# EAGLE design emonDCmini v0.8 (EAGLE 9.4.2)
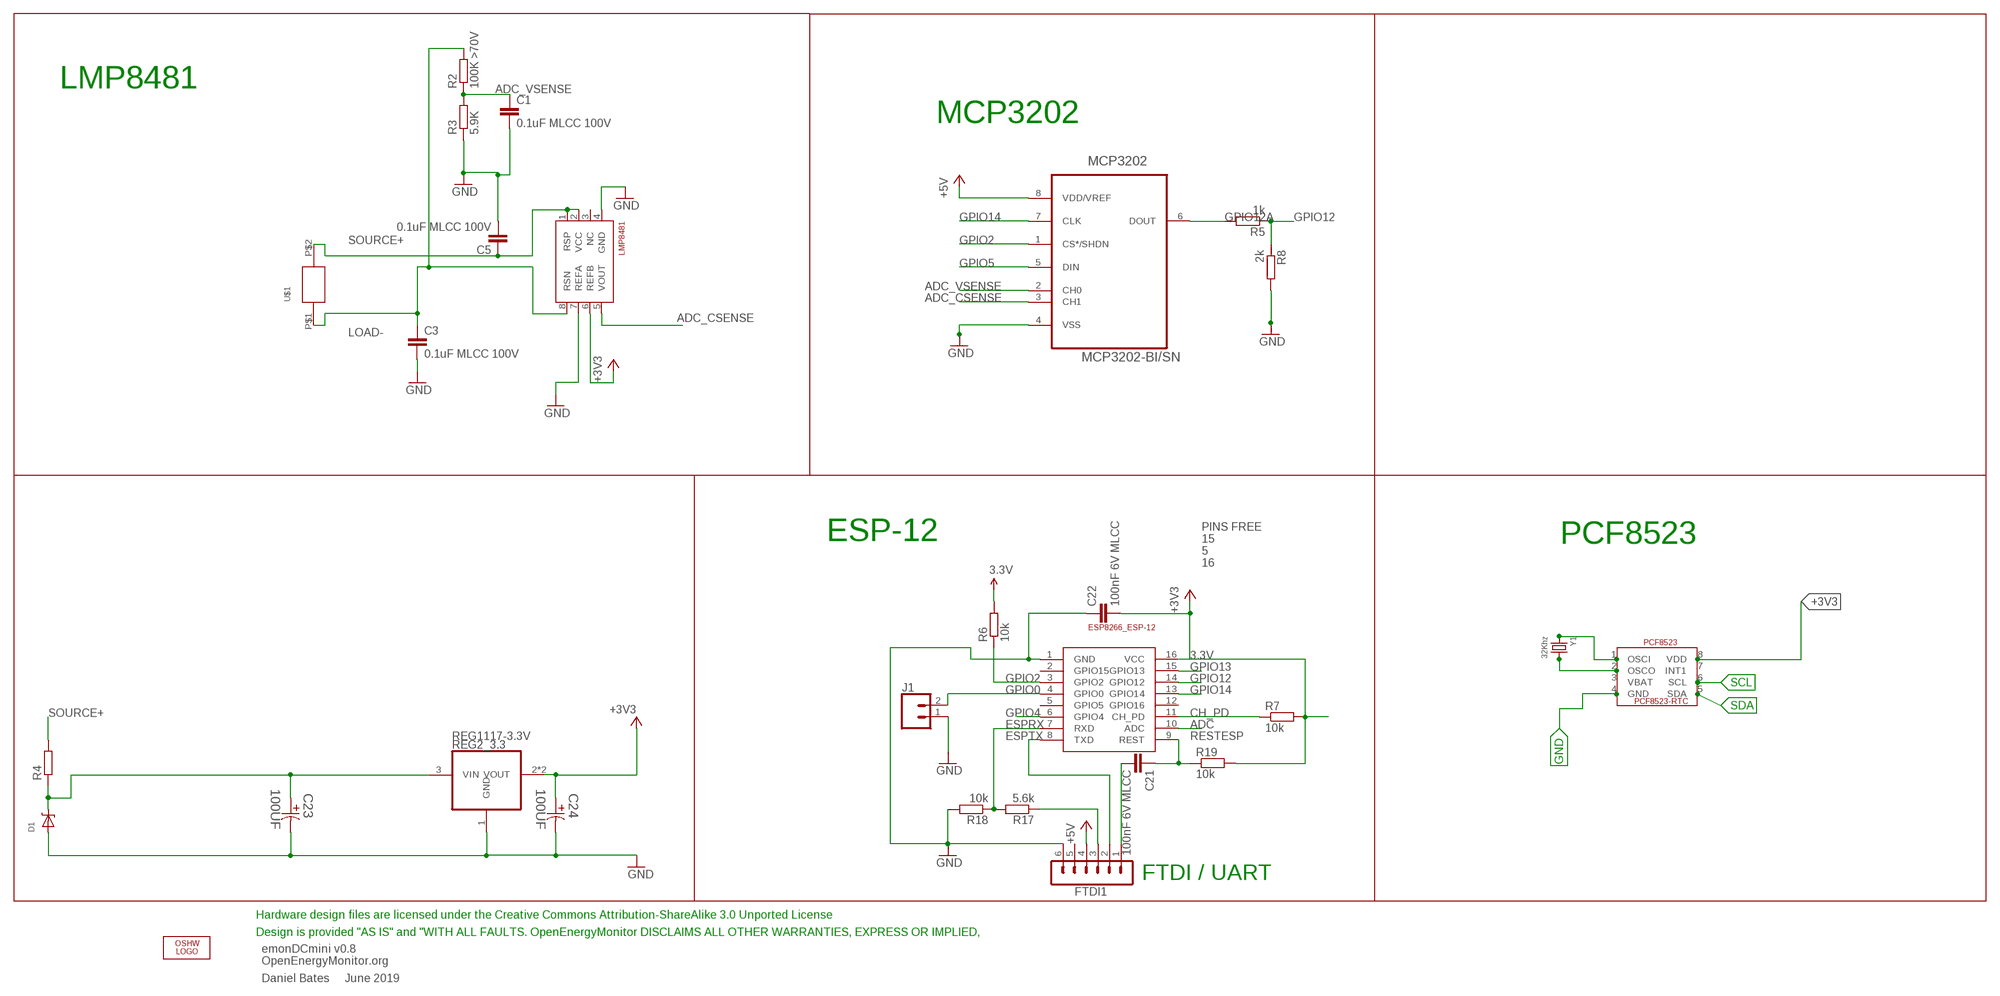
[diagram p0: schematic, sheet 1]

## Parts
C1  0.1uF MLCC 100V  C-EUC0805  [C0805]
C3  0.1uF MLCC 100V  C-EUC0805  [C0805]
C5  0.1uF MLCC 100V  C-EUC0805  [C0805]
C21  100nF 6V MLCC  C-EUC0805  [C0805]
C22  100nF 6V MLCC  C-EUC0805  [C0805]
C23  100UF  EEE-0JA101WAR-CASE-C  [CAPAE530X610N]
C24  100UF  EEE-0JA101WAR-CASE-C  [CAPAE530X610N]
D1  DIODE-ZENER  [SMADIODE]
ESP-12  ESP8266_ESP-12  [ESP8266-ESP12]
FTDI1  FTDI-ESP  MA06-1  [MA06-1]
J1  CONN_02  [1X02]
LMP8481  LMP8481-H  LMP8481LMP8481-H  [S-PDSO-G08]
LOGO1  OSHW_LOGO_6MILX0200-NT  [OSHW_6X200_NOTEXT]
MCP3202  MCP3202-BI/SN  [SOIC127P600X175-8N]
PCF8523  PCF8523_RTC  [SOIC_8]
R2  100K >70V  R-EU_R0603  [R0603]
R3  5.9K  R-EU_R0603  [R0603]
R4  R-EU_R2512  [R2512]
R5  1k  R-EU_R0603  [R0603]
R6  10k  R-EU_R0603  [R0603]
R7  10k  R-EU_R0603  [R0603]
R8  2k  R-EU_R0603  [R0603]
R17  5.6k  R-EU_R0603  [R0603]
R18  10k  R-EU_R0603  [R0603]
R19  10k  R-EU_R0603  [R0603]
REG2_3.3  REG1117-3.3V  REG1117  [SOT223]
U$1  EBW_SERIES_10.5MM  [EBW_SERIES_10.5MM]
Y1  32Khz  CRYSTAL8X3.8SMT  [CRYSTAL_8X3.8]

## Nets
3.3V: C22.2 ESP-12.16(VCC) LMP8481.6(REFB) R6.2 R7.2 R19.2 ; supply symbol labelled +3V3
6.5V [thin_power]: C23.1 D1.C R4.1 REG2_3.3.3(VIN)
+3V3 [thin_power]: C24.1 PCF8523.8(VDD) REG2_3.3.2(VOUT) REG2_3.3.4(VOUT)
+5V: FTDI1.4 MCP3202.8(VDD/VREF)
ADC: ESP-12.10(ADC)
ADC_CSENSE: LMP8481.5(VOUT) MCP3202.3(CH1)
ADC_VSENSE: C1.1 MCP3202.2(CH0) R2.1 R3.2
CH_PD: ESP-12.11(CH_PD) R7.1
ESPRX: ESP-12.7(RXD) R17.2 R18.1
ESPTX: ESP-12.8(TXD) FTDI1.2
GND [thin_power]: C1.2 C3.2 C5.2 C22.1 C23.2 C24.2 D1.A ESP-12.1(GND) FTDI1.6 J1.1 LMP8481.4(GND) LMP8481.7(REFA) MCP3202.4(VSS) PCF8523.4(GND) R3.1 R8.2 R18.2 REG2_3.3.1(GND)
GPIO0: ESP-12.4(GPIO0) J1.2
GPIO2: ESP-12.3(GPIO2) MCP3202.1(CS*/SHDN) R6.1
GPIO4: ESP-12.6(GPIO4)
GPIO5: MCP3202.5(DIN)
GPIO12: ESP-12.14(GPIO12) R5.1 R8.1
GPIO12A: MCP3202.6(DOUT) R5.2
GPIO13: ESP-12.15(GPIO13)
GPIO14: ESP-12.13(GPIO14) MCP3202.7(CLK)
LOAD- [power]: C3.1 LMP8481.8(RSN) R2.2 U$1.P$1
N$36: FTDI1.3 R17.1
N$44: PCF8523.2(OSCO) Y1.P$4
N$45: PCF8523.1(OSCI) Y1.P$1
RESTESP: C21.1 ESP-12.9(REST) R19.1
RST: C21.2 FTDI1.1
SCL: PCF8523.6(SCL)
SDA: PCF8523.5(SDA)
SOURCE+ [power]: C5.1 LMP8481.1(RSP) LMP8481.2(VCC) R4.2 U$1.P$2
Unconnected: ESP-12.2(GPIO15) ESP-12.5(GPIO5) ESP-12.12(GPIO16) FTDI1.5 LMP8481.3(NC) PCF8523.3(VBAT) PCF8523.7(INT1)

## Notes on the sheet
- LMP8481
- MCP3202
- ESP-12 | PCF8523
- PINS FREE
  15
  5
  16
- FTDI / UART
- Hardware design files are licensed under the Creative Commons Attribution-ShareAlike 3.0 Unported License
- Design is provided "AS IS" and "WITH ALL FAULTS. OpenEnergyMonitor DISCLAIMS ALL OTHER WARRANTIES, EXPRESS OR IMPLIED,
- emonDCmini v0.8
  OpenEnergyMonitor.org
- Daniel Bates     June 2019

## Library data of the parts
C1 C3 C5 C21 C22 = rcl:C-EU: CAPACITOR, European symbol; SPICEPREFIX: C
C23 C24 = Panasonic-EEE0_EEE1_EEE2_EEEFC:EEE-: Aluminum Electrolytic Capacitors,Surface Mount Type; MPN: EEE-0JA101WAR; OC_FARNELL: 2284723; OC_NEWARK: 53W3731; PACKAGE: CASE-C; SUPPLIER: PANASONIC; TOLERANCE: 20%; VOLTAGERATING: 6.3V
D1 = microbuilder:DIODE-ZENER: Zener Diode SMA: 30V 1W Zener Diode, 1.2Vf - Digikey: SMAZ30-FDICT-ND
ESP-12 = ESP8266-ESP12:ESP8266_ESP-12
FTDI1 = JeeLabs:MA06-1: PIN HEADER
J1 = SparkFun-Connectors:CONN_02: Multi connection point. Often used as Generic Header-pin footprint for 0.1 inch spaced/style header connections On any of the 0.1 inch spaced packages, you can populate with these: Break Away Headers - Straight <https://www.sparkfun.com/products/116> (PRT-00116) Break Away Male Headers - Right Angle <https://www.sparkfun.com/products/553> (PRT-00553) Female Headers <https://www.sparkfun.com/products/115> (PRT-00115) Break Away Headers - Machine Pin <https://www.sparkfun.com/products/117> (PRT-00117) Break Away Female Headers - Swiss Machine Pin <https://www.sparkfun.com/products/743> (PRT-00743) For SCREWTERMINALS and SPRING TERMINALS visit here: Screw Terimnals on SparkFun.com <https://www.sparkfun.com/search/results?term=Screw+Terminals> (5mm/3.5mm/2.54mm spacing) This device is also useful as a general connection point to wire up your design to another part of your project. Our various solder wires solder well into these plated through hole pads. Hook-Up Wire - Assortment (Stranded, 22 AWG) <https://www.sparkfun.com/products/11375> (PRT-11375) Hook-Up Wire - Assortment (Solid Core, 22 AWG) <https://www.sparkfun.com/products/11367> (PRT-11367) View the entire wire category on our website here <https://www.sparkfun.com/categories/141> Special notes: Molex polarized connector foot print use with: PRT-08233 with associated crimp pins and housings. 2.54_SCREWTERM for use with PRT-10571. 3.5mm Screw Terminal footprints for PRT-08084 5mm Screw Terminal footprints for use with PRT-08432
LMP8481 = lmp8481b:LMP8481: LMP8481MM-H/NOPB 100V/V
LOGO1 = ohw-logo:OSHW_LOGO_6MIL; OC_FARNELL: unknown
MCP3202 = Microchip-MCP3202-BI_SN:MCP3202-BI/SN: IC ADC 12BIT 2.7V 2CH SPI,SOIC-8; MPN: MCP3202-BI/SN; OC_FARNELL: 1196803; OC_NEWARK: 96K3721; PACKAGE: SOIC-8; SUPPLIER: Microchip
PCF8523 = emonDC parts:PCF8523_RTC: PCF8523-RTC SOIC-8
R2 = rcl:R-EU_: RESISTOR, European symbol; MPN: MCWR06X1003FTL
R3 = rcl:R-EU_: RESISTOR, European symbol; MPN: MCWR06X5901FTL
R4 = rcl:R-EU_: RESISTOR, European symbol; SPICEPREFIX: R
R5-R8 R17-R19 = rcl:R-EU_: RESISTOR, European symbol
REG2_3.3 = burr-brown-db:REG1117: 800mA and 1A Low Dropout (LDO) Positive Regulator 1.8V, 2.5V, 2.85V, 3.3V, 5V, and Adj; MF: TEXAS INSTRUMENTS; MPN: REG1117-3.3; OC_FARNELL: 1097566; OC_NEWARK: 14P6981
U$1 = EBW series SHUNT:EBW_SERIES_10.5MM
Y1 = microbuilder:CRYSTAL: Crystals HC49UP - Surface Mount Crystal 4.0MHz 18pF +/-30ppm Surface Mount Crystal [Digikey: 535-9857-1-ND] 12.0 MHz Surface Mount Crystal [Digikey: 535-9869-6-ND] 25.0 MHz Surface Mount Crystal [Digikey: 535-9078-1-ND] 2.5 x 2.0mm - MEMs SMT Crystal 16.0 MHz 10pF 20ppm 2.5 x 2.0mm Crystal [Digikey -40-85°C: 535-10923-1-ND] 3.2 x 2.5mm - MEMs SMT Crystal 12.0 MHz 8pF 15ppm 3.2 x 2.5mm Crystal [Digikey: -10-70°C: 644-1047-1-ND -40-125°C: 644-1128-1-ND] 16.0 MHz 8pF 15ppm 3.2 x 2.5mm Crystal [Digikey: -10-70°C: 644-1049-1-ND -40-125°C: 644-1129-2-ND] 16.0 MHz 10pF 10ppm 3.2 x 2.5mm Crystal [Digikey: 644-1100-1-ND] 27.12 MHz 18pF 30ppm 3.2 x 2.5mm Crystal [Digikey: 887-1424-1-ND] 27.12MHz 10pF 10ppm 3.2 x 2.5mm Crystal [Digikey: 887-1329-1-ND] 4.9 x 1.8mm - MEMs SMT Crystal 32.768 KHz 12.5pF 20ppm 4.9 x 1.8mm Crystal [Digikey: SE2415CT-ND] 8.0 x 3.8mm - Surface Mount Crystal 32.768kHz 12.5pF 20ppm -40°C-85°C [Digikey: 535-9166-2-ND] Cylinder 32.768KHz Cylinder Crystal (2x6mm body) [Ex. Digikey: 300-8341-2-ND]

## Net classes
0 default: clearance 0.254 mm
1 power: width 1.016 mm
2 thin_power: width 0.254 mm, clearance 0.254 mm
3 thin_power2: width 0.254 mm, clearance 0.254 mm

## Board
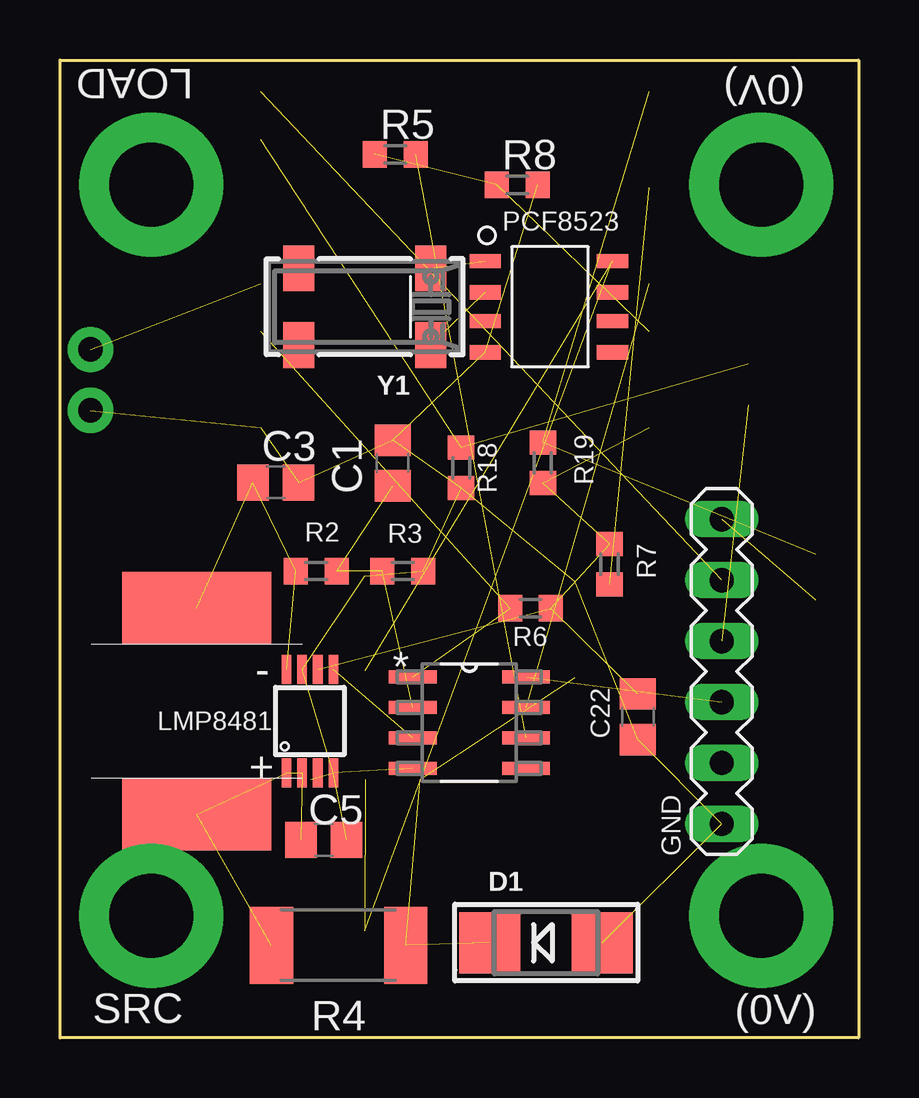
[diagram p1: board, top side]
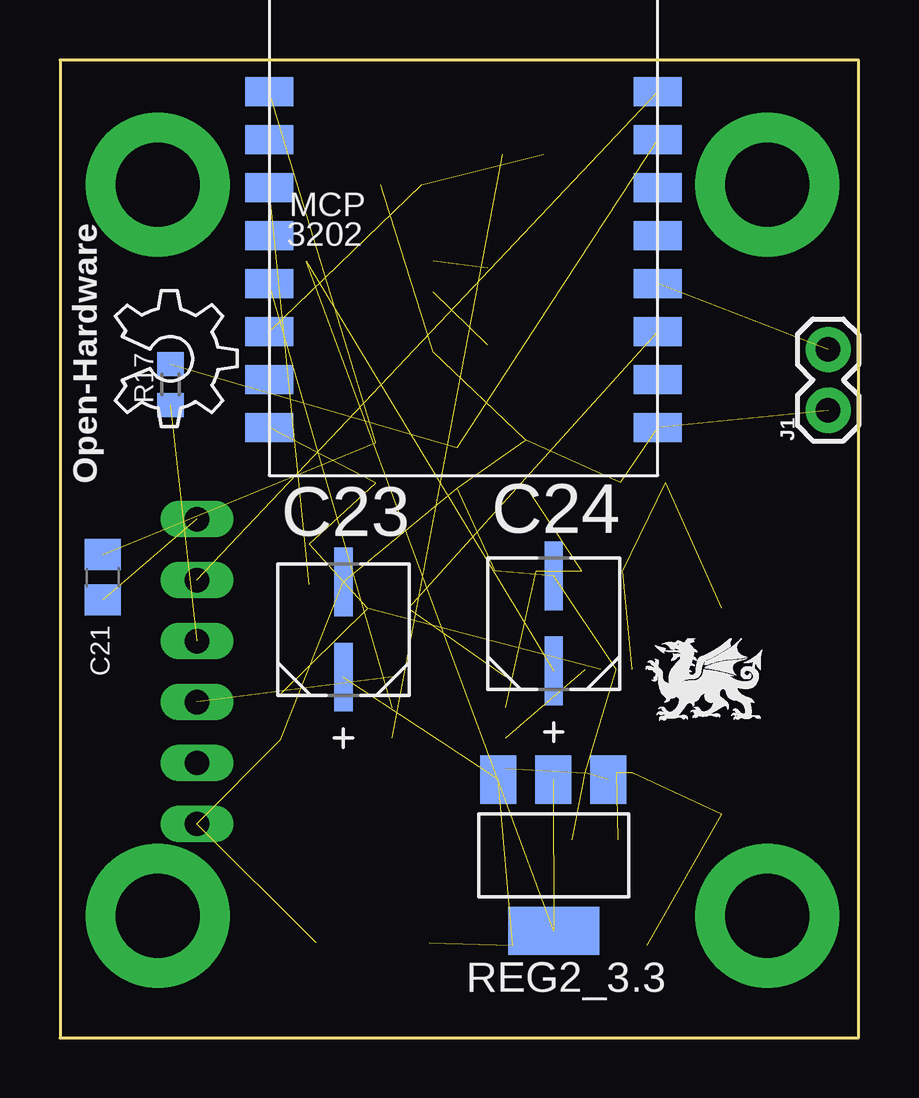
[diagram p2: board, bottom side, seen from below]

Size 33.27 x 40.77 mm. Coordinates in mm from the lower left corner, seen from the top.
Outline: 0,40.77 33.27,40.77 33.27,0 0,0 0,40.77
Copper layers (1*16): Top 0.035mm / dielectric 1.5mm / Bottom 0.035mm
Design rules "default *": minimum track width 10mil, minimum drill 19mil, track to track 8mil, track to pad 8mil, pad to pad 8mil, via to via 8mil, smd to smd 8mil, copper to edge 25mil, drill to drill 8mil, minimum pad ring 10mil, minimum via ring 8mil, stop-mask expansion 4mil, vias tented up to drill 0mil, thermal gap 5mil

### Footprints (pad centres in the part's own frame; a part is rotated, then mirrored left to right if it is on the bottom)
C0805 = smd 1.3 x 1.5: 1 -0.95,0; 2 0.95,0
CAPAE530X610N = smd 2.87 x 0.762: 1 -1.981,0; 2 1.981,0
SMADIODE = smd 2.54 x 2.54: A 2.349,0; C -2.349,0
ESP8266-ESP12 = smd 2 x 1.2: 1 16.2,2; 2 16.2,4; 3 16.2,6; 4 16.2,8; 5 16.2,10; 6 16.2,12; 7 16.2,14; 8 16.2,16; 9 0,16; 10 0,14; 11 0,12; 12 0,10; 13 0,8; 14 0,6; 15 0,4; 16 0,2
MA06-1 = drill 1.016 long: 1 0,0; 2 2.54,0; 3 5.08,0; 4 7.62,0; 5 10.16,0; 6 12.7,0
1X02 = drill 1.016 pad 1.88: 1 0,0; 2 2.54,0
S-PDSO-G08 = smd 0.4 x 1.2: 1 -0.975,-2.157; 2 -0.325,-2.157; 3 0.325,-2.157; 4 0.975,-2.157; 5 0.975,2.157; 6 0.325,2.157; 7 -0.325,2.157; 8 -0.975,2.157
SOIC127P600X175-8N = smd 1.981 x 0.559: 1 -2.362,1.905; 2 -2.362,0.635; 3 -2.362,-0.635; 4 -2.362,-1.905; 5 2.362,-1.905; 6 2.362,-0.635; 7 2.362,0.635; 8 2.362,1.905
SOIC_8 = smd 1.3 x 0.6: 1 -2.6,1.9; 2 -2.6,0.6; 3 -2.6,-0.6; 4 -2.6,-1.9; 5 2.7,-1.9; 6 2.7,-0.6; 7 2.7,0.6; 8 2.7,1.9
R0603 = smd 1 x 1.1: 1 -0.85,0; 2 0.85,0
R2512 = smd 1.8 x 3.2: 1 -2.8,0; 2 2.8,0
SOT223 = smd 1.499 x 2.007: 1 -2.261,-3.15; 2 0.025,-3.15; 3 2.311,-3.15 | smd 3.81 x 2.007: 4 0,3.15
EBW_SERIES_10.5MM = smd 3 x 6.2: P$1 -4.3,0; P$2 4.3,0
CRYSTAL_8X3.8 = smd 1.3 x 1.9: P$1 -2.75,-1.6; P$2 2.75,-1.6; P$3 2.75,1.6; P$4 -2.75,1.6

### Placement (x,y rotation side)
C1  13.86,23.96 90 top
C3  8.99,23.16 0 top
C5  10.99,8.26 0 top
C21  31.5,19.2 270 bottom
C22  24.08,13.39 90 top
C23  21.46,17.02 90 bottom
C24  12.7,17.27 90 bottom
D1  20.25,3.97 0 top
ESP-12  24.56,23.44 0 bottom
FTDI1  27.57,21.62 270 top
J1  1.27,26.16 90 bottom
LMP8481  10.41,13.21 0 top
LOGO1  30.96,31.16 270 bottom
MCP3202  17.06,13.14 0 top
PCF8523  20.32,30.48 0 top
R2  10.68,19.46 180 top
R3  14.28,19.46 180 top
R4  11.61,3.87 180 top
R5  13.97,36.83 0 top
R6  19.61,17.91 0 top
R7  22.9,19.75 90 top
R8  19.05,35.56 0 top
R17  28.67,27.24 90 bottom
R18  16.72,23.77 270 top
R19  20.12,23.98 270 top
REG2_3.3  12.7,7.62 180 bottom
U$1  5.7,13.63 270 top
U$3  [DRAGON_LOGO_NOTEXT]  6.27,14.91 0 bottom
Y1  12.7,30.48 180 top

### Tracks (layer width: path | path; a pad name or v marks a point on that pad's centre or on a via)
3.3V  (5 unrouted)
6.5V  (3 unrouted)
+3V3  (3 unrouted)
+5V  (1 unrouted)
ADC_CSENSE  (1 unrouted)
ADC_VSENSE  (3 unrouted)
CH_PD  (1 unrouted)
ESPRX  (2 unrouted)
ESPTX  (1 unrouted)
GND  (17 unrouted)
GPIO0  (1 unrouted)
GPIO2  (2 unrouted)
GPIO12  (2 unrouted)
GPIO12A  (1 unrouted)
GPIO14  (1 unrouted)
LOAD-  (3 unrouted)
N$1  (via drill 3.5 pad 6)
  other vias: 3.81,5.08
N$2  (via drill 3.5 pad 6)
  other vias: 29.21,35.56
N$3  (via drill 3.5 pad 6)
  other vias: 3.81,35.56
N$4  (via drill 3.5 pad 6)
  other vias: 29.21,5.08
N$36  (1 unrouted)
N$44  (1 unrouted)
N$45  (1 unrouted)
RESTESP  (2 unrouted)
RST  (1 unrouted)
SOURCE+  (4 unrouted)

### Text on the board
bPlace: Open-Hardware
tNames: emonDCmini v0.8 | micro WiFi enabled / DC power monitor / and datalogger | LOAD | (0V) | GND | SRC | (0V)
bNames: MCP | 3202
_tsilk: Designed in | North Wales | Made in UK
_bsilk: SMT V0.6 rev3 | emonTx | wireless energy monitoring node | SMT V0.6 rev3 | emonTx | SMT V0.6 rev3 | emonTx | Technology that helps us live within ecological limits | wireless energy monitoring node | wireless energy monitoring node | Designed in North Wales UK by Glyn Hudson & Trystan Lea | Technology that helps us live within ecological limits | Technology that helps us live within ecological limits | Designed in North Wales UK by Glyn Hudson & Trystan Lea | 165mm ant | 433Mhz | Designed in North Wales UK by Glyn Hudson & Trystan Lea | 165mm ant | 165mm ant | 433Mhz | 433Mhz | 868Mhz | 82mm ant | 82mm ant | 82mm ant | 868Mhz | 868Mhz | 78mm ant | 915Mhz | 78mm ant | 915Mhz | 78mm ant | 915Mhz | 165mm ant | 433Mhz | 82mm ant | 868Mhz | 78mm ant | 915Mhz